# Altium project Motor_Board.PrjPcb
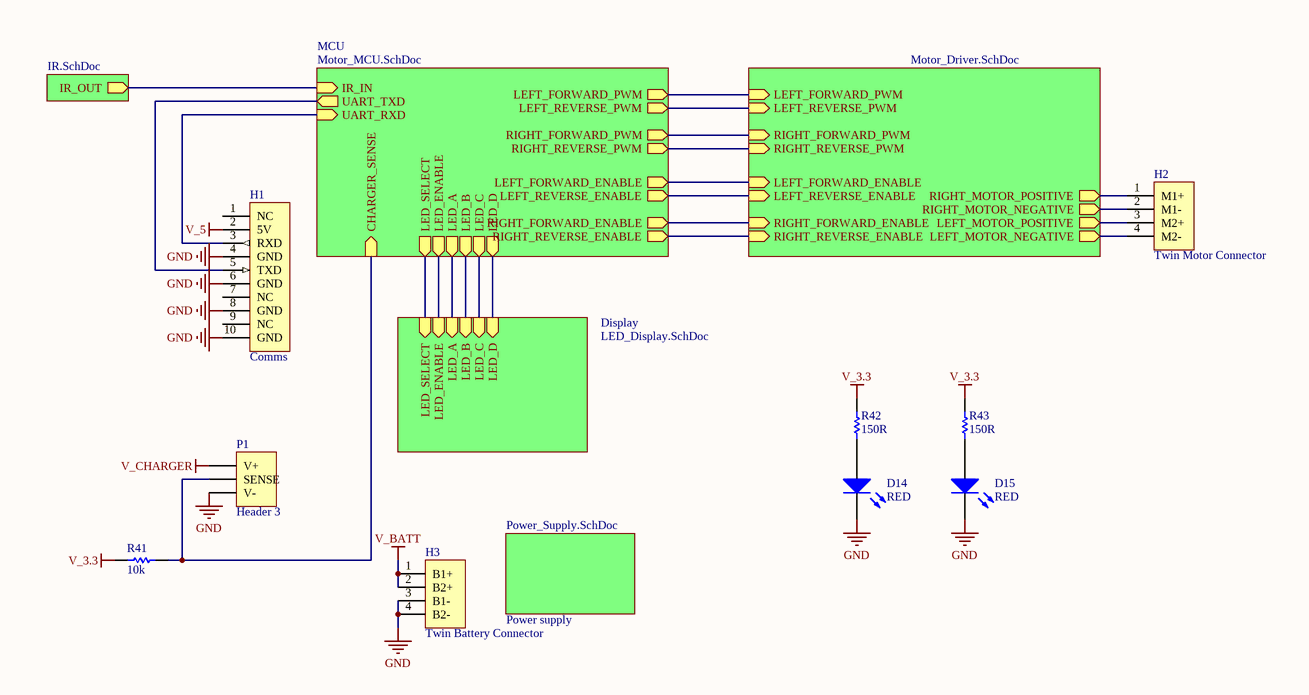
[diagram p0: Motor_Board.SchDoc]
6 sheets, 123 parts. Net scope: hierarchical (ports join the sheet entries above them; power ports are global).
Board file: Motor_Board.PcbDoc
Sheets:
  Motor_Board.SchDoc
    Power supply = Power_Supply.SchDoc
     = Motor_Driver.SchDoc
     = IR.SchDoc
    MCU = Motor_MCU.SchDoc
    Display = LED_Display.SchDoc

## Sheet Motor_Board.SchDoc: Top Level - Motor Board
size A4; DrawnBy: wgl18, hvj10; Organization: ENEL429 Group 9; Address1: ECE Department; Address2: University of Canterbury; Address3: Christchurch 8041; Address4: New Zealand; Revision: 1; SheetNumber: 1; SheetTotal: 5

### Parts
D14  value RED  [Diode_0805]  (hidden comment: LED Red)
D15  value RED  [Diode_0805]  (hidden comment: LED Red)
H1  Comms  [918510x323]
H2  Twin Motor Connector  [TMHDR4]
H3  Twin Battery Connector  [TMHDR4]
P1  Header 3  [DC power jack]
R41  10k  [0603]
R42  150R  [0603]
R43  150R  [0603]

### Sub-sheets
Display = LED_Display.SchDoc: LED_ENABLE (in), LED_A (in), LED_B (in), LED_C (in), LED_D (in), LED_SELECT (in)
MCU = Motor_MCU.SchDoc: LEFT_FORWARD_PWM (out), LEFT_REVERSE_PWM (out), RIGHT_REVERSE_PWM (out), RIGHT_FORWARD_PWM (out), UART_RXD (in), UART_TXD (out), IR_IN (in), LED_SELECT (out), LED_ENABLE (out), LED_A (out), LED_B (out), LED_C (out), LED_D (out), LEFT_FORWARD_ENABLE (out), LEFT_REVERSE_ENABLE (out), RIGHT_REVERSE_ENABLE (out), RIGHT_FORWARD_ENABLE (out), CHARGER_SENSE (in)
Power supply = Power_Supply.SchDoc: no entries
? = Motor_Driver.SchDoc: LEFT_FORWARD_PWM (in), RIGHT_REVERSE_PWM (in), LEFT_MOTOR_POSITIVE (out), RIGHT_MOTOR_POSITIVE (out), LEFT_REVERSE_PWM (in), RIGHT_FORWARD_PWM (in), RIGHT_MOTOR_NEGATIVE (out), LEFT_MOTOR_NEGATIVE (out), RIGHT_REVERSE_ENABLE (in), RIGHT_FORWARD_ENABLE (in), LEFT_FORWARD_ENABLE (in), LEFT_REVERSE_ENABLE (in)
? = IR.SchDoc: IR_OUT (out)

### Nets
GND: D14.2(K) D15.2(K) H1.4(GND) H1.6(GND) H1.8(GND) H1.10(GND) H3.3(B1-) H3.4(B2-) P1.3(V-)
V_3.3: R41.1 R42.2 R43.2
V_5: H1.2(5V)
V_BATT: H3.1(B1+) H3.2(B2+)
V_CHARGER: P1.1(V+)
PA0: sheet MCU/LED_A, sheet Display/LED_A
PA1: sheet MCU/LED_B, sheet Display/LED_B
PA2: sheet MCU/LED_C, sheet Display/LED_C
PA3: sheet MCU/LED_D, sheet Display/LED_D
PA6: sheet MCU/LED_ENABLE, sheet Display/LED_ENABLE
PA7: sheet MCU/LED_SELECT, sheet Display/LED_SELECT
PB2: P1.2(SENSE) R41.2 ; sheet MCU/CHARGER_SENSE
PD0: sheet /IR_OUT, sheet MCU/IR_IN
PD2: H1.3(RXD) ; sheet MCU/UART_RXD
PD3: H1.5(TXD) ; sheet MCU/UART_TXD
PD4: sheet /RIGHT_REVERSE_ENABLE, sheet MCU/RIGHT_REVERSE_ENABLE
PD5: sheet /RIGHT_FORWARD_ENABLE, sheet MCU/RIGHT_FORWARD_ENABLE
PD6: sheet /LEFT_FORWARD_ENABLE, sheet MCU/LEFT_FORWARD_ENABLE
PD7: sheet /LEFT_REVERSE_ENABLE, sheet MCU/LEFT_REVERSE_ENABLE
PE0: sheet /RIGHT_FORWARD_PWM, sheet MCU/RIGHT_FORWARD_PWM
PE1: sheet /RIGHT_REVERSE_PWM, sheet MCU/RIGHT_REVERSE_PWM
PE2: sheet /LEFT_REVERSE_PWM, sheet MCU/LEFT_REVERSE_PWM
PE3: sheet /LEFT_FORWARD_PWM, sheet MCU/LEFT_FORWARD_PWM
Net*1_6: H2.3(M2+) ; sheet /LEFT_MOTOR_POSITIVE
Net*2_6: H2.4(M2-) ; sheet /LEFT_MOTOR_NEGATIVE
Net*3_6: H2.1(M1+) ; sheet /RIGHT_MOTOR_POSITIVE
Net*4_6: H2.2(M1-) ; sheet /RIGHT_MOTOR_NEGATIVE
NetD14_1: D14.1(A) R42.1
NetD15_1: D15.1(A) R43.1

Not connected (* = marked no-connect by the designer): H1 1(NC) 7(NC) 9(NC)

### Notes on the sheet
- Title
- Drawn by:
- Date:
- Time:
- Revision:
- Sheet
- of
- File:

### Library data of the parts
D14 D15 = DL_LED Red 0805: Red LED 0805; Manufacturer PN: TLMS2100-GS08; Manufacturer: Vishay; Supplier 1: Digi-Key; Supplier Part Number 1: 350-2038-1-ND; Part Number: DL_LED Red 0805; Component Kind: Standard; Component Type: Standard; Designator: DL_LED Red 0805; Pin Count: 2; Simulation: LED0
H1 = Header 10: Header, IDC 10-Pin; LatestRevisionDate: 17-Jul-2002; LatestRevisionNote: Re-released for DXP Platform.; Publisher: Altium Limited
H2 H3 = AVR ISP Header 4: 5.08mm Pluggable Terminal Header; LatestRevisionDate: 17-Jul-2002; LatestRevisionNote: Re-released for DXP Platform.; Publisher: Altium Limited
P1 = Header 3: Header, 3-Pin; pin to pad: 1>3 3>1; LatestRevisionDate: 17-Jul-2002; LatestRevisionNote: Re-released for DXP Platform.; Publisher: Altium Limited
R41 = RS_10k 0603: RES 10.0K OHM 1/10W 1% 0603 SMD; Manufacturer: Yageo; Manufacturer PN: RC0603FR-0710KL; LatestRevisionDate: 29 May 08; Supplier 1: Digi-Key; Supplier Part Number 1: 311-10.0KHRTR-ND; Value: 10k; Part Number: RS_10k 0603; Component Kind: Standard; Component Type: Standard; Designator: RS_10k 0603; Pin Count: 2; Signal Integrity: Res; Simulation: RESISTOR
R42 R43 = RS_150R 0603: RES 150 OHM 1/10W 1% 0603 SMD; Manufacturer: ROHM; Manufacturer PN: MCR03EZPFX1500; LatestRevisionDate: 4th July 08; Supplier 1: Digi-Key; Supplier Part Number 1: RHM150HTR-ND; Value: 150R; Part Number: RS_150R 0603; Component Kind: Standard; Component Type: Standard; Designator: RS_150R 0603; Pin Count: 2; Signal Integrity: Res; Simulation: RESISTOR

## Sheet Power_Supply.SchDoc: Power Supply
size A4; DrawnBy: hvj10; Organization: ENEL429 Group 9; Address1: ECE Department; Address2: University of Canterbury; Address3: Christchurch 8041; Address4: New Zealand; Revision: 1; SheetNumber: 3; SheetTotal: 5
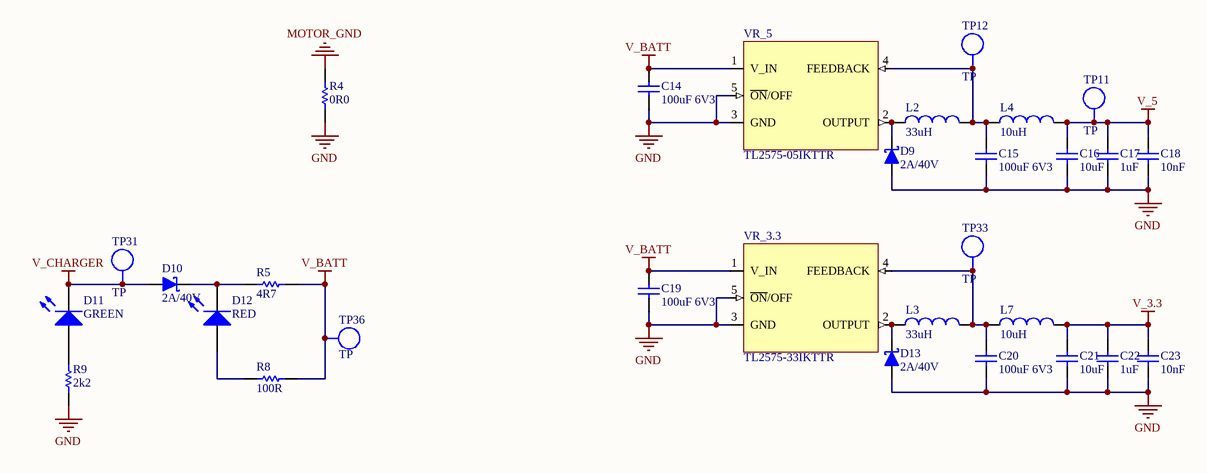
[diagram p1: Power_Supply.SchDoc]

### Parts
C14  100uF 6V3  [1206]
C15  100uF 6V3  [1206]
C16  10uF  [0805]
C17  1uF  [0603]
C18  10nF  [0603]
C19  100uF 6V3  [1206]
C20  100uF 6V3  [1206]
C21  10uF  [0805]
C22  1uF  [0603]
C23  10nF  [0603]
D9  2A/40V  [SMB_DIODE]
D10  2A/40V  [SMB_DIODE]
D11  value GREEN  [DIODE_0805]  (hidden comment: LED Green)
D12  value RED  [Diode_0805]  (hidden comment: LED Red)
D13  2A/40V  [SMB_DIODE]
L2  value 33uH  [DR124]  (hidden comment: Inductor)
L3  value 33uH  [DR124]  (hidden comment: Inductor)
L4  10uH  [WE-PD]
L7  10uH  [WE-PD]
R4  0R0  [0603]  (no BOM)
R5  4R7  [0603]
R8  100R  [0603]
R9  2k2  [0603]
TP11  TP  [TEST_POINT_4X2MM]  (no BOM)
TP12  TP  [TEST_POINT_4X2MM]  (no BOM)
TP31  TP  [TEST_POINT_4X2MM]  (no BOM)
TP33  TP  [TEST_POINT_4X2MM]  (no BOM)
TP36  TP  [TEST_POINT_4X2MM]  (no BOM)
VR_3.3  TL2575-33IKTTR  [TO170P1524X483-6N]
VR_5  TL2575-05IKTTR  [TO170P1524X483-6N]

### Nets
GND: C14.1 C15.1 C16.1 C17.1 C18.1 C19.1 C20.1 C21.1 C22.1 C23.1 D9.1(A) D13.1(A) R4.2 R9.1 VR_3.3.3(GND) VR_3.3.5(~{ON}/OFF) VR_3.3.6(GND) VR_5.3(GND) VR_5.5(~{ON}/OFF) VR_5.6(GND)
MOTOR_GND: R4.1
V_3.3: C21.2 C22.2 C23.2 L7.2
V_5: C16.2 C17.2 C18.2 L4.2 TP11.1
V_BATT: C14.2 C19.2 R5.2 R8.2 TP36.1 VR_3.3.1(V_IN) VR_5.1(V_IN)
V_CHARGER: D10.1(A) D11.2(K) TP31.1
NetC15_2: C15.2 L2.2 L4.1 TP12.1 VR_5.4(FEEDBACK)
NetC20_2: C20.2 L3.2 L7.1 TP33.1 VR_3.3.4(FEEDBACK)
NetD9_2: D9.2(K) L2.1 VR_5.2(OUTPUT)
NetD10_2: D10.2(K) D12.2(K) R5.1
NetD11_1: D11.1(A) R9.2
NetD12_1: D12.1(A) R8.1
NetD13_2: D13.2(K) L3.1 VR_3.3.2(OUTPUT)

### Notes on the sheet
- Title
- Drawn by:
- Date:
- Time:
- Revision:
- Sheet
- of
- File:

### Library data of the parts
C14 C15 C19 C20 = CP_CER 100uF_1206_6V3: 100uF 6.3V 1206 multi-layer ceramic capacitor; Manufacturer PN: C1206C107M9PACTU; Manufacturer: Kemet; Supplier Part Number 1: 399-5620-1-ND; price: 2.56; Supplier 1: Digi-Key; value: 100uF 6V3; Part Number: CP_CER 100uF_1206_6V3; Component Kind: Standard; Component Type: Standard; Designator: CP_CER 100uF_1206_6V3; Pin Count: 2
C16 C21 = CP_10uF 0805: CAP 10uF 10% 10V X5R 0805; Manufacturer: Murata; Manufacturer PN: GRM219R61A106KE44D; LatestRevisionDate: 29 May 08; Supplier 1: Digi-Key; Supplier Part Number 1: 490-4735-1-ND; Value: 10uF; Part Number: CP_10uF 0805; Component Kind: Standard; Component Type: Standard; Designator: CP_10uF 0805; Pin Count: 2
C17 C22 = CP_1uF_50V_0603: CAP CER 1.0UF 50V X7R 0603; Manufacturer: Taiyo Yuden; Manufacturer PN: UMK107C5105KA-T; Supplier Part Number 1: 445-5090-2-ND; Supplier 1: Digi-Key; Value: 1uF; Part Number: CP_1uF_50V_0603; Component Kind: Standard; Component Type: Standard; Designator: CP_1uF_50V_0603; Pin Count: 2; Signal Integrity: Cap; Simulation: CAP
C18 C23 = CP_10nF 0603: CAP CER 10000PF 100V X7R 0603; Manufacturer: Taiyo Yuden; Manufacturer PN: HMK107B7103KA-T; Supplier 1: Digi-Key; Supplier Part Number 1: 587-1446-2-ND; Value: 10nF; Part Number: CP_10nF 0603; Component Kind: Standard; Component Type: Standard; Designator: CP_10nF 0603; Pin Count: 2; Signal Integrity: Cap; Simulation: CAP
D9 D10 D13 = DS_SS230TP: Schottky Diode - 2A/30V; Manufacturer: Discrete Semiconductor Products; Manufacturer PN: SS23; Signal Integrity: D Schottky; LatestRevisionDate: 20 Feb 09; Supplier Part Number 1: SS23-TPMSCT-ND; Supplier 1: Digi-Key; Value: 2A/40V; Part Number: DS_SS230TP; Component Kind: Standard; Component Type: Standard; Designator: DS_SS230TP; Pin Count: 2; Simulation: SKYDIODE
D11 = DL_LED Green 0805: Green LED 0805; Manufacturer: Vishay; Verify: Not checked; Supplier 1: Digi-Key; Supplier Part Number 1: 160-1179-2-ND; Part Number: DL_LED Green 0805; Component Kind: Standard; Component Type: Standard; Designator: DL_LED Green 0805; Footprint: LED_RA_SMD; Pin Count: 2; Simulation: LED0
D12 = DL_LED Red 0805: as D14 on sheet Motor_Board; Supplier 1: Digi-Key; Supplier Part Number 1: 350-2038-1-ND; Part Number: DL_LED Red 0805; Component Kind: Standard; Component Type: Standard; Designator: DL_LED Red 0805; Pin Count: 2; Simulation: LED0
L2 L3 = IN_33u 2A SMT: INDUCTOR POWER SHIELD 33UH 2.6A SMD; Manufacturer: Coiltronics; Manufacturer PN: DR124-330-R; Verify: Not Checked; LatestRevisionDate: 20 Feb 09; Supplier 1: Digi-Key; Supplier Part Number 1: 513-1435-1-ND; Part Number: IN_33u 2A SMT; Component Kind: Standard; Component Type: Standard; Designator: IN_33u 2A SMT; Pin Count: 2; Signal Integrity: Inductor; Simulation: INDUCTOR
L4 L7 = IN_10uH 2A SMT: INDUCTOR POWER 10UH 2.0A SMD; Manufacturer: Wurth Electronics Inc; Manufacturer PN: 744777910; LatestRevisionDate: 29 May 08; Supplier 1: Digi-Key; Supplier Part Number 1: 732-1191-1-ND; Value: 10uH; Part Number: IN_10uH 2A SMT; Component Kind: Standard; Component Type: Standard; Designator: IN_10uH 2A SMT; Pin Count: 2; Signal Integrity: Inductor; Simulation: INDUCTOR
R4 = RS_0R0 0603: RES 0.0 OHM 1/10W 5% 0603 SMD; Manufacturer: Rohm; Manufacturer PN: MCR03EZPJ000; LatestRevisionDate: 3 Jun 08; Supplier 1: Digi-Key; Supplier Part Number 1: RHM0.0GTR-ND; Value: 0R0; Part Number: RS_0R0 0603; Component Type: Standard (No BOM); Designator: RS_0R0 0603; Pin Count: 2; Signal Integrity: Res; Simulation: RESISTOR
R5 = RS_4R7_0603: RES 4.7R 1/10W 5% 0603 SMD; Manufacturer: Yageo; Manufacturer PN: RC0603JR-074R7L; Verify: Not Checked; LatestRevisionDate: 20 Feb 09; Supplier 1: Digi-Key; Supplier Part Number 1: 311-4.7GRTR-ND; Value: 4R7; Part Number: RS_4R7_0603; Component Kind: Standard; Component Type: Standard; Designator: RS_4R7_0603; Pin Count: 2; Signal Integrity: Res; Simulation: RESISTOR
R8 = RS_100R 0603: RES 100 OHM 1/10W 1% 0603 SMD; Manufacturer: ROHM; Manufacturer PN: MCR03EZPFX1000; LatestRevisionDate: n/a; Supplier 1: Digi-Key; Supplier Part Number 1: RHM100HTR-ND; Value: 100R; Part Number: RS_100R 0603; Component Kind: Standard; Component Type: Standard; Designator: RS_100R 0603; Pin Count: 2; Signal Integrity: Res; Simulation: RESISTOR
R9 = RS_2k2 0603: RES 2.2K OHM 1/10W 5% 0603 SMD; Manufacturer: Yageo; Manufacturer PN: RC0603JR-072K2L; LatestRevisionDate: 1 Jun 08; Supplier 1: Digi-Key; Supplier Part Number 1: 311-2.2KGRTR-ND; Value: 2k2; Part Number: RS_2k2 0603; Component Kind: Standard; Component Type: Standard; Designator: RS_2k2 0603; Pin Count: 2; Signal Integrity: Res; Simulation: RESISTOR
TP11 TP12 TP31 TP33 TP36 = TP_TESTPOINT: Test-Point; Value: TP; Part Number: TP_TESTPOINT; Component Type: Standard (No BOM); Designator: TP_TESTPOINT; Pin Count: 1; LatestRevisionDate: 29 May 08; Manufacturer PN: *; Manufacturer: *; Supplier 1: Digi-Key; Supplier Part Number 1: 5016KTR-ND
VR_3.3 = TL2575-33IKTTR: Manufacturer: TEXAS INSTRUMENTS; Manufacturer PN: TL2575-33IKTTR; Supplier 1: TI Samples; Supplier Part Number 1: TL2575-33IKTTR; Supplier 2: Digikey; Supplier Part Number 2: 296-21828-1-ND
VR_5 = TL2575-05IKTTR: Manufacturer: TEXAS INSTRUMENTS; Manufacturer PN: TL2575-05IKTTR; Supplier 1: TI Samples; Supplier Part Number 1: TL2575-05IKTTR

## Sheet Motor_Driver.SchDoc: Motor Driver
size A4; DrawnBy: wgl18; Organization: ENEL429 Group 9; Address1: ECE Department; Address2: University of Canterbury; Address3: Christchurch 8041; Address4: New Zealand; Revision: 1; SheetNumber: 4; SheetTotal: 5
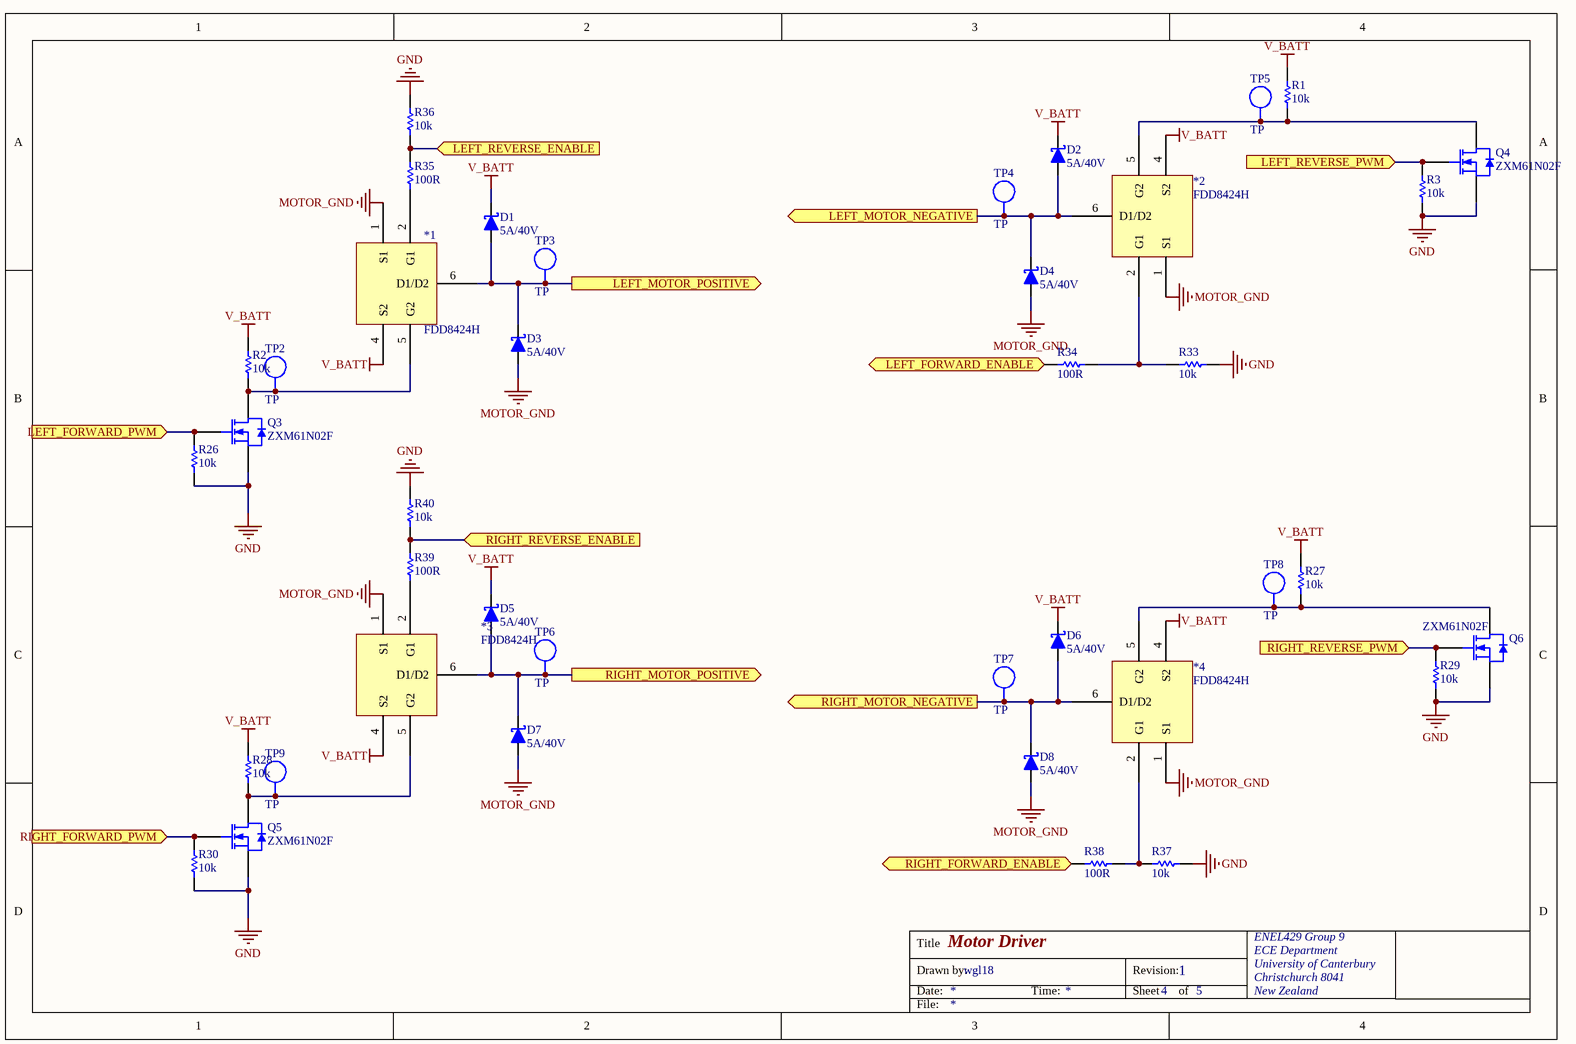
[diagram p2: Motor_Driver.SchDoc]

### Parts
*1  FDD8424H  [TO114P990X239-5N]
*2  FDD8424H  [TO114P990X239-5N]
*3  FDD8424H  [TO114P990X239-5N]
*4  FDD8424H  [TO114P990X239-5N]
D1  5A/40V  [DIODE_SMC]
D2  5A/40V  [DIODE_SMC]
D3  5A/40V  [DIODE_SMC]
D4  5A/40V  [DIODE_SMC]
D5  5A/40V  [DIODE_SMC]
D6  5A/40V  [DIODE_SMC]
D7  5A/40V  [DIODE_SMC]
D8  5A/40V  [DIODE_SMC]
Q3  ZXM61N02F  [SOT-23]
Q4  ZXM61N02F  [SOT-23]
Q5  ZXM61N02F  [SOT-23]
Q6  ZXM61N02F  [SOT-23]
R1  10k  [0603]
R2  10k  [0603]
R3  10k  [0603]
R26  10k  [0603]
R27  10k  [0603]
R28  10k  [0603]
R29  10k  [0603]
R30  10k  [0603]
R33  10k  [0603]
R34  100R  [0603]
R35  100R  [0603]
R36  10k  [0603]
R37  10k  [0603]
R38  100R  [0603]
R39  100R  [0603]
R40  10k  [0603]
TP2  TP  [TEST_POINT_4X2MM]  (no BOM)
TP3  TP  [TEST_POINT_4X2MM]  (no BOM)
TP4  TP  [TEST_POINT_4X2MM]  (no BOM)
TP5  TP  [TEST_POINT_4X2MM]  (no BOM)
TP6  TP  [TEST_POINT_4X2MM]  (no BOM)
TP7  TP  [TEST_POINT_4X2MM]  (no BOM)
TP8  TP  [TEST_POINT_4X2MM]  (no BOM)
TP9  TP  [TEST_POINT_4X2MM]  (no BOM)

### Ports
LEFT_FORWARD_ENABLE (in), LEFT_FORWARD_PWM (in), LEFT_MOTOR_NEGATIVE (out), LEFT_MOTOR_POSITIVE (out), LEFT_REVERSE_ENABLE (in), LEFT_REVERSE_PWM (in), RIGHT_FORWARD_ENABLE (in), RIGHT_FORWARD_PWM (in), RIGHT_MOTOR_NEGATIVE (out), RIGHT_MOTOR_POSITIVE (out), RIGHT_REVERSE_ENABLE (in), RIGHT_REVERSE_PWM (in)

### Nets
GND: Q3.2(S) Q4.2(S) Q5.2(S) Q6.2(S) R3.1 R26.2 R29.1 R30.2 R33.2 R36.1 R37.2 R40.1
MOTOR_GND: *1.1(S1) *2.1(S1) *3.1(S1) *4.1(S1) D3.1(A) D4.1(A) D7.1(A) D8.1(A)
V_BATT: *1.4(S2) *2.4(S2) *3.4(S2) *4.4(S2) D1.2(K) D2.2(K) D5.2(K) D6.2(K) R1.2 R2.1 R27.2 R28.1
PD4: R39.2 R40.2 ; port RIGHT_REVERSE_ENABLE
PD5: R38.1 ; port RIGHT_FORWARD_ENABLE
PD6: R34.1 ; port LEFT_FORWARD_ENABLE
PD7: R35.2 R36.2 ; port LEFT_REVERSE_ENABLE
PE0: Q5.1(G) R30.1 ; port RIGHT_FORWARD_PWM
PE1: Q6.1(G) R29.2 ; port RIGHT_REVERSE_PWM
PE2: Q4.1(G) R3.2 ; port LEFT_REVERSE_PWM
PE3: Q3.1(G) R26.1 ; port LEFT_FORWARD_PWM
Net*1_2: *1.2(G1) R35.1
Net*1_5: *1.5(G2) Q3.3(D) R2.2 TP2.1
Net*1_6: *1.6(D1/D2) D1.1(A) D3.2(K) TP3.1 ; port LEFT_MOTOR_POSITIVE
Net*2_2: *2.2(G1) R33.1 R34.2
Net*2_5: *2.5(G2) Q4.3(D) R1.1 TP5.1
Net*2_6: *2.6(D1/D2) D2.1(A) D4.2(K) TP4.1 ; port LEFT_MOTOR_NEGATIVE
Net*3_2: *3.2(G1) R39.1
Net*3_5: *3.5(G2) Q5.3(D) R28.2 TP9.1
Net*3_6: *3.6(D1/D2) D5.1(A) D7.2(K) TP6.1 ; port RIGHT_MOTOR_POSITIVE
Net*4_2: *4.2(G1) R37.1 R38.2
Net*4_5: *4.5(G2) Q6.3(D) R27.1 TP8.1
Net*4_6: *4.6(D1/D2) D6.1(A) D8.2(K) TP7.1 ; port RIGHT_MOTOR_NEGATIVE

Not connected (* = marked no-connect by the designer): *1 3(DNC); *2 3(DNC); *3 3(DNC); *4 3(DNC)

### Notes on the sheet
- Title
- Drawn by:
- Date:
- Time:
- Revision:
- Sheet
- of
- File:

### Library data of the parts
*1-*4 = FDD8424H: Manufacturer: Fairchild Semiconductor; Supplier 1: Digikey; Manufacturer PN: FDD8424H; Supplier Part Number 1: FDD8424HCT-ND
D1-D8 = DS_SSC54-E3/57T: DIODE SCHOTTKY 5A 40V SMC; Manufacturer: Vishay; Verify: Not Checked; Value: 5A/40V; Part Number: DS_SSC54-E3/57T; Component Kind: Standard; Component Type: Standard; Designator: DS_SSC54-E3/57T; Pin Count: 2; LatestRevisionDate: 2 Mar 09; Manufacturer PN: SSC54-E3/57T; Supplier 1: Digi-Key; Supplier Part Number 1: SSC54-E3/57TGICT-ND
Q3-Q6 = TF_ZXM61N02F: 20V N-channel enhancement mode MOSFET; Manufacturer: Zetex; Supplier 1: Element 14; Supplier Part Number 1: 9525270; price: 1.28; Supplier 2: Digi-Key; Supplier Part Number 2: ZXM61N02FCT-ND; value: ZXM61N02F; Part Number: TF_ZXM61N02F; Component Kind: Standard; Component Type: Standard; Designator: TF_ZXM61N02F; Pin Count: 3; PCB3D: sot23
R1-R3 R26-R30 R33 R36 R37 R40 = RS_10k 0603: as R41 on sheet Motor_Board; LatestRevisionDate: 29 May 08; Supplier 1: Digi-Key; Supplier Part Number 1: 311-10.0KHRTR-ND; Value: 10k; Part Number: RS_10k 0603; Component Kind: Standard; Component Type: Standard; Designator: RS_10k 0603; Pin Count: 2; Signal Integrity: Res; Simulation: RESISTOR
R34 R35 R38 R39 = RS_100R 0603: as R8 on sheet Power_Supply; LatestRevisionDate: n/a; Supplier 1: Digi-Key; Supplier Part Number 1: RHM100HTR-ND; Value: 100R; Part Number: RS_100R 0603; Component Kind: Standard; Component Type: Standard; Designator: RS_100R 0603; Pin Count: 2; Signal Integrity: Res; Simulation: RESISTOR
TP2-TP9 = TP_TESTPOINT: Test-Point; Value: TP; Part Number: TP_TESTPOINT; LatestRevisionDate: 29 May 08; Manufacturer PN: *; Manufacturer: *; Supplier 1: Digi-Key; Supplier Part Number 1: 5016KTR-ND; Component Type: Standard (No BOM); Designator: TP_TESTPOINT; Pin Count: 1

## Sheet IR.SchDoc: IR Module
size A4; DrawnBy: djb216; Organization: ENEL429 Group 9; Address1: ECE Department; Address2: University of Canterbury; Address3: Christchurch 8041; Address4: New Zealand; Revision: 2; SheetNumber: 5; SheetTotal: 5
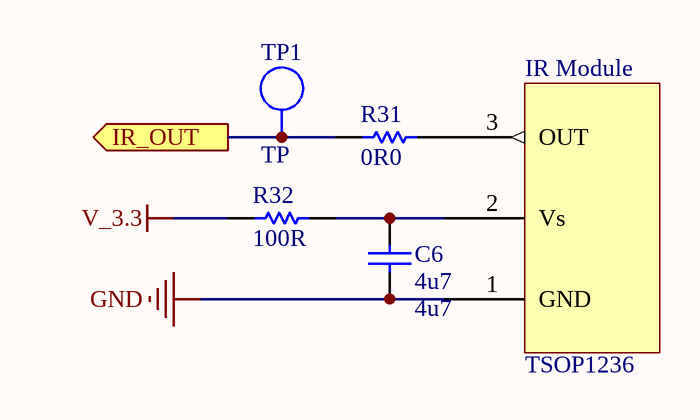
[diagram p3: IR.SchDoc]

### Parts
C6  4u7  [0603]
IR_Module  TSOP1236  [TSOP1236 IR Receiver]
R31  0R0  [0603]  (no BOM)
R32  100R  [0603]
TP1  TP  [TEST_POINT_4X2MM]  (no BOM)

### Ports
IR_OUT (out)

### Nets
GND: C6.2 IR_Module.1(GND)
V_3.3: R32.1
PD0: R31.1 TP1.1 ; port IR_OUT
NetC6_1: C6.1 IR_Module.2(Vs) R32.2
NetIR_Module_3: IR_Module.3(OUT) R31.2

### Notes on the sheet
- Title
- Drawn by:
- Date:
- Time:
- Revision:
- Sheet
- of
- File:

### Library data of the parts
C6 = CP_4u7 0603: CAP CER 4.7UF 10V X5R 0603; Manufacturer: Taiyo Yuden LMK107BJ475KA-T; Value: 4u7; Part Number: CP_4u7 0603; Component Kind: Standard; Component Type: Standard; Designator: CP_4u7 0603; Pin Count: 2; LatestRevisionDate: 29 May 08; Supplier 1: Digi-Key; Supplier Part Number 1: 587-1441-1-ND; Simulation: CAP
IR_Module = TSOP1236: Manufacturer: VISHAY; Manufacturer PN: TSOP1236; Supplier Part Number 1: 4913048; Supplier 1: Element14
R31 = RS_0R0 0603: as R4 on sheet Power_Supply; LatestRevisionDate: 3 Jun 08; Supplier 1: Digi-Key; Supplier Part Number 1: RHM0.0GTR-ND; Value: 0R0; Part Number: RS_0R0 0603; Component Type: Standard (No BOM); Designator: RS_0R0 0603; Pin Count: 2; Signal Integrity: Res; Simulation: RESISTOR
R32 = RS_100R 0603: as R8 on sheet Power_Supply; Value: 100R; Part Number: RS_100R 0603; Component Kind: Standard; Component Type: Standard; Designator: RS_100R 0603; Pin Count: 2; LatestRevisionDate: n/a; Supplier 1: Digi-Key; Supplier Part Number 1: RHM100HTR-ND; Signal Integrity: Res; Simulation: RESISTOR
TP1 = TP_TESTPOINT: Test-Point; Value: TP; Part Number: TP_TESTPOINT; Component Type: Standard (No BOM); Designator: TP_TESTPOINT; Pin Count: 1; LatestRevisionDate: 29 May 08; Manufacturer PN: *; Manufacturer: *; Supplier 1: Digi-Key; Supplier Part Number 1: 5016KTR-ND

## Sheet Motor_MCU.SchDoc: Motor MCU
size A4; Author: wgl18; DrawnBy: wgl18; Organization: ENEL429 Group 9; Address1: ECE Department; Address2: University of Canterbury; Address3: Christchurch 8041; Address4: New Zealand; DocumentNumber: 1; Revision: 1; SheetNumber: 2; SheetTotal: 5; ProjectName: Wacky Racers
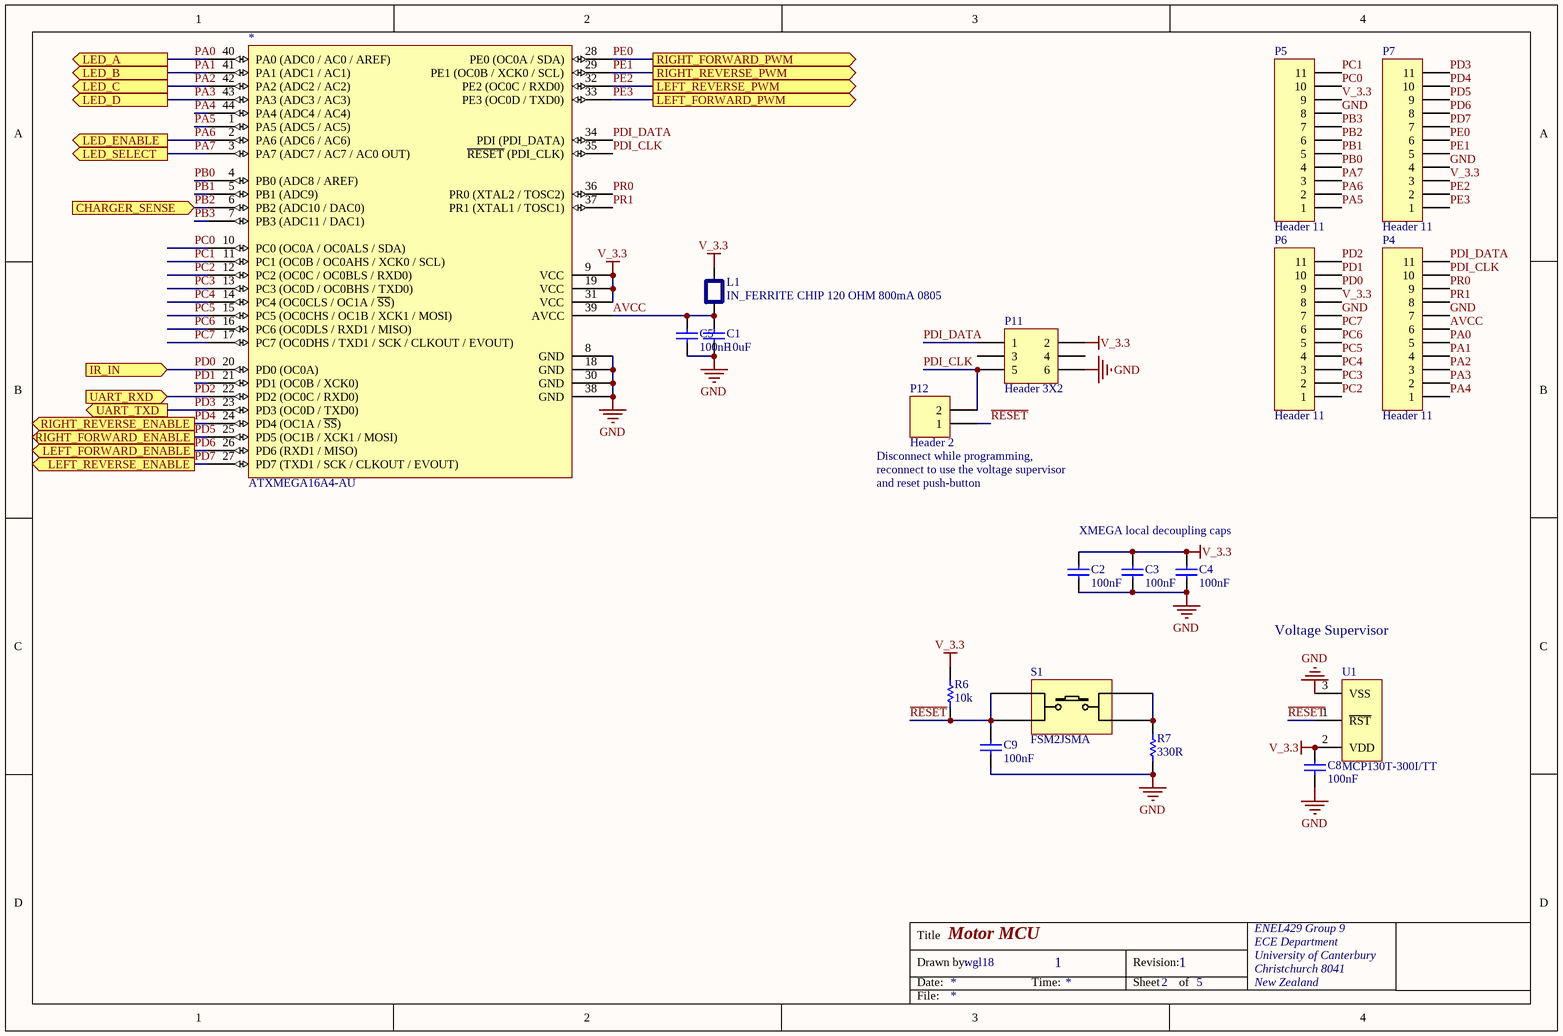
[diagram p4: Motor_MCU.SchDoc]

### Parts
*  ATXMEGA16A4-AU  [TQFP80P1200X1200X120-44N]
C1  10uF  [0805]
C2  100nF  [0603]
C3  100nF  [0603]
C4  100nF  [0603]
C5  100nF  [0603]
C8  100nF  [0603]
C9  100nF  [0603]
L1  IN_FERRITE CHIP 120 OHM 800mA 0805  [0805]
P4  Header 11  [HDR1X11]
P5  Header 11  [HDR1X11]
P6  Header 11  [HDR1X11]
P7  Header 11  [HDR1X11]
P11  Header 3X2  [HDR2X3]
P12  Header 2  [HDR1X2]
R6  10k  [0603]
R7  330R  [0603]
S1  FSM2JSMA  [FSM2JSMA]
U1  MCP130T-300I/TT  [SOT-23-TT3_N]

### Ports
CHARGER_SENSE (in), IR_IN (in), LED_A (out), LED_B (out), LED_C (out), LED_D (out), LED_ENABLE (out), LED_SELECT (out), LEFT_FORWARD_ENABLE (out), LEFT_FORWARD_PWM (out), LEFT_REVERSE_ENABLE (out), LEFT_REVERSE_PWM (out), RIGHT_FORWARD_ENABLE (out), RIGHT_FORWARD_PWM (out), RIGHT_REVERSE_ENABLE (out), RIGHT_REVERSE_PWM (out), UART_RXD (in), UART_TXD (out)

### Nets
GND: *.8(GND) *.18(GND) *.30(GND) *.38(GND) C1.2 C2.1 C3.1 C4.1 C5.1 C8.2 C9.2 P4.7 P5.8 P6.7 P7.4 P11.6 R7.1 U1.3(VSS)
V_3.3: *.9(VCC) *.19(VCC) *.31(VCC) C2.2 C3.2 C4.2 C8.1 L1.1 P5.9 P6.8 P7.3 P11.2 R6.2 U1.2(VDD)
AVCC: *.39(AVCC) C1.1 C5.2 L1.2 P4.6
PA0: *.40(PA0_(ADC0_/_AC0_/_AREF)) P4.5 ; port LED_A
PA1: *.41(PA1_(ADC1_/_AC1)) P4.4 ; port LED_B
PA2: *.42(PA2_(ADC2_/_AC2)) P4.3 ; port LED_C
PA3: *.43(PA3_(ADC3_/_AC3)) P4.2 ; port LED_D
PA4: *.44(PA4_(ADC4_/_AC4)) P4.1
PA5: *.1(PA5_(ADC5_/_AC5)) P5.1
PA6: *.2(PA6_(ADC6_/_AC6)) P5.2 ; port LED_ENABLE
PA7: *.3(PA7_(ADC7_/_AC7_/_AC0_OUT)) P5.3 ; port LED_SELECT
PB0: *.4(PB0_(ADC8_/_AREF)) P5.4
PB1: *.5(PB1_(ADC9)) P5.5
PB2: *.6(PB2_(ADC10_/_DAC0)) P5.6 ; port CHARGER_SENSE
PB3: *.7(PB3_(ADC11_/_DAC1)) P5.7
PC0: *.10(PC0_(OC0A_/_OC0ALS_/_SDA)) P5.10
PC1: *.11(PC1_(OC0B_/_OC0AHS_/_XCK0_/_SCL)) P5.11
PC2: *.12(PC2_(OC0C_/_OC0BLS_/_RXD0)) P6.1
PC3: *.13(PC3_(OC0D_/_OC0BHS_/_TXD0)) P6.2
PC4: *.14(PC4_(OC0CLS_/_OC1A_/_~{SS})) P6.3
PC5: *.15(PC5_(OC0CHS_/_OC1B_/_XCK1_/_MOSI)) P6.4
PC6: *.16(PC6_(OC0DLS_/_RXD1_/_MISO)) P6.5
PC7: *.17(PC7_(OC0DHS_/_TXD1_/_SCK_/_CLKOUT_/_EVOUT)) P6.6
PD0: *.20(PD0_(OC0A)) P6.9 ; port IR_IN
PD1: *.21(PD1_(OC0B_/_XCK0)) P6.10
PD2: *.22(PD2_(OC0C_/_RXD0)) P6.11 ; port UART_RXD
PD3: *.23(PD3_(OC0D_/_TXD0)) P7.11 ; port UART_TXD
PD4: *.24(PD4_(OC1A_/_~{SS})) P7.10 ; port RIGHT_REVERSE_ENABLE
PD5: *.25(PD5_(OC1B_/_XCK1_/_MOSI)) P7.9 ; port RIGHT_FORWARD_ENABLE
PD6: *.26(PD6_(RXD1_/_MISO)) P7.8 ; port LEFT_FORWARD_ENABLE
PD7: *.27(PD7_(TXD1_/_SCK_/_CLKOUT_/_EVOUT)) P7.7 ; port LEFT_REVERSE_ENABLE
PDI_CLK: *.35(~{RESET}_(PDI_CLK)) P4.10 P11.5 P12.2
PDI_DATA: *.34(PDI_(PDI_DATA)) P4.11 P11.1
PE0: *.28(PE0_(OC0A_/_SDA)) P7.6 ; port RIGHT_FORWARD_PWM
PE1: *.29(PE1_(OC0B_/_XCK0_/_SCL)) P7.5 ; port RIGHT_REVERSE_PWM
PE2: *.32(PE2_(OC0C_/_RXD0)) P7.2 ; port LEFT_REVERSE_PWM
PE3: *.33(PE3_(OC0D_/_TXD0)) P7.1 ; port LEFT_FORWARD_PWM
PR0: *.36(PR0_(XTAL2_/_TOSC2)) P4.9
PR1: *.37(PR1_(XTAL1_/_TOSC1)) P4.8
~{RESET}: C9.1 P12.1 R6.1 S1.1 S1.2 U1.1(~{RST})
NetR7_2: R7.2 S1.3 S1.4

Not connected (* = marked no-connect by the designer): P11 3 4

### Notes on the sheet
- (near P12) Disconnect while programming,
- (near P12) reconnect to use the voltage supervisor
- and reset push-button
- XMEGA local decoupling caps
- Voltage Supervisor
- Title
- Drawn by:
- Date:
- Time:
- Revision:
- Sheet
- of
- File:

### Library data of the parts
* = ATXMEGA16A4-AU: Manufacturer: ATMEL; Manufacturer PN: ATXMEGA16A4-AU; Supplier 1: Element 14; Supplier Part Number 1: 1748552
C1 = CP_10uF 0805: as C16 on sheet Power_Supply; Value: 10uF; Part Number: CP_10uF 0805; Component Kind: Standard; Component Type: Standard; Designator: CP_10uF 0805; Pin Count: 2; LatestRevisionDate: 29 May 08; Supplier 1: Digi-Key; Supplier Part Number 1: 490-4735-1-ND
C2-C5 C8 C9 = CP_100nF 0603: CAP CER .10UF 50V X5R 0603; Manufacturer: Taiyo Yuden; Manufacturer PN: UMK107B7104KA-T; Value: 100nF; Part Number: CP_100nF 0603; Component Kind: Standard; Component Type: Standard; Designator: CP_100nF 0603; Pin Count: 2; LatestRevisionDate: 29 May 08; Supplier 1: Digi-Key; Supplier Part Number 1: 478-6206-1-ND; Signal Integrity: Cap; Simulation: CAP
L1 = IN_FERRITE CHIP 120 OHM 800mA 0805: FERRITE CHIP 120 OHM 800mA 0805; Manufacturer: TDK; Manufacturer PN: MMZ2012Y121B; Part Number: IN_FERRITE CHIP 120 OHM 800mA 0805; Component Kind: Standard; Component Type: Standard; Designator: IN_FERRITE CHIP 120 OHM 800mA 0805; Pin Count: 2; Supplier 1: Digi-Key; Supplier Part Number 1: 445-2196-2-ND
P4-P7 = Header 11: Header, 11-Pin; LatestRevisionDate: 17-Jul-2002; LatestRevisionNote: Re-released for DXP Platform.; Publisher: Altium Limited
P11 = Header 3X2: Header, 3-Pin, Dual row; LatestRevisionDate: 17-Jul-2002; LatestRevisionNote: Re-released for DXP Platform.; Publisher: Altium Limited
P12 = Header 2: Header, 2-Pin; LatestRevisionDate: 17-Jul-2002; LatestRevisionNote: Re-released for DXP Platform.; Publisher: Altium Limited
R6 = RS_10k 0603: as R41 on sheet Motor_Board; Value: 10k; Part Number: RS_10k 0603; Component Kind: Standard; Component Type: Standard; Designator: RS_10k 0603; Pin Count: 2; LatestRevisionDate: 29 May 08; Supplier 1: Digi-Key; Supplier Part Number 1: 311-10.0KHRTR-ND; Signal Integrity: Res; Simulation: RESISTOR
R7 = RS_330R 0603: RES 330 OHM 1/10W 1% 0603 SMD; Manufacturer: Yageo; Manufacturer PN: RC0603FR-07330RL; Value: 330R; Part Number: RS_330R 0603; Component Kind: Standard; Component Type: Standard; Designator: RS_330R 0603; Pin Count: 2; LatestRevisionDate: 25 June 2009; Supplier 1: Digi-Key; Supplier Part Number 1: 311-330HRTR-ND; Signal Integrity: Res; Simulation: RESISTOR
S1 = SW_FSM2JSMA: DPST SMD Switch; Manufacturer: Tyco Electronics; Supplier 1: Element 14; Supplier Part Number 1: 3801287; price: 0.516; Supplier 2: Digi-Key; Supplier Part Number 2: 450-1130-ND; value: FSM2JSMA; Part Number: SW_FSM2JSMA; Component Kind: Standard; Component Type: Standard; Designator: SW_FSM2JSMA; Pin Count: 4
U1 = MCP130T-300I/TT: Microcontroller Supervisory Circuit with Open Drain Output, 3-Pin SOT-23, Industrial Temperature, Tape and Reel; FirstPublished: 29-Jan-2009; DatasheetVersion: revD, 2001; PackageVersion: revBB, Aug-2009; PackageReference: SOT-23-TT3; Publisher: Altium Limited; PackageDescription: 3-Lead Plastic Small Outline Transistor (TT) [SOT-23]; Supplier 1: Digi-Key; Supplier Part Number 1: MCP130T-300I/TTTR-ND; Supplier 2: Digi-Key; Supplier Part Number 2: MCP130T-300I/TTCT-ND; Supplier 3: Digi-Key; Supplier Part Number 3: MCP130T-300I/TTDKR-ND; Supplier 4: Farnell; Supplier Part Number 4: 1332070; Supplier 5: Newark; Supplier Part Number 5: 19C7176; Code_IPC: SOT23-3; ComponentLink1Description: Datasheet; ComponentLink1URL: http://ww1.microchip.com/downloads/en/DeviceDoc/11184d.pdf; ComponentLink2Description: Packaging Specification; ComponentLink2URL: http://www.microchip.com/stellent/groups/techpub_sg/documents/packagingspec/en012702.pdf; ComponentLink3Description: Microchip.com Home; ComponentLink3URL: http://www.microchip.com/

## Sheet LED_Display.SchDoc
size A4; Organization: ENEL429 Group N; Address1: ECE Department; Address2: University of Canterbury; Address3: Christchurch 8041; Address4: New Zealand; Revision: 1
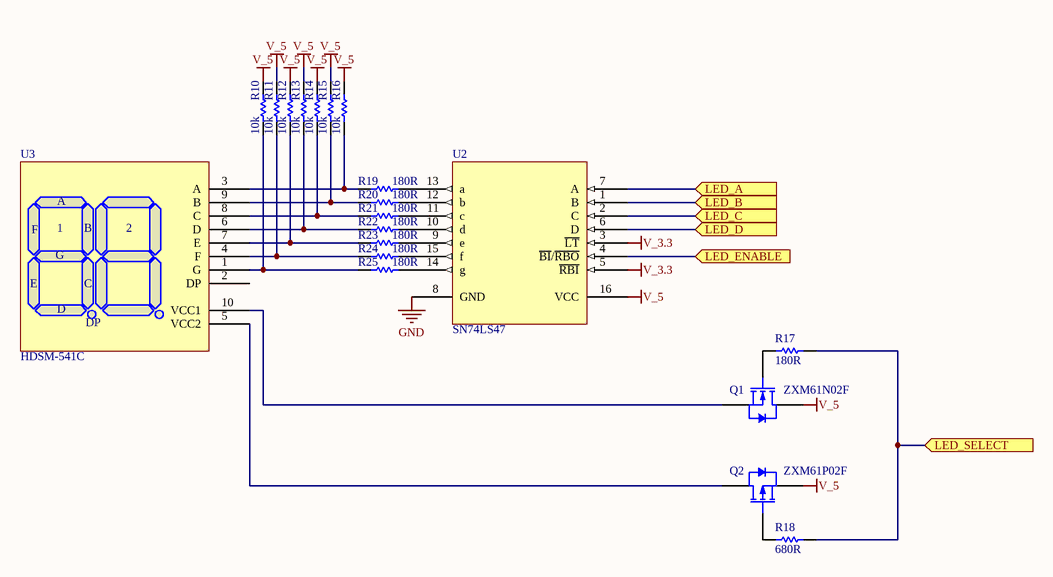
[diagram p5: LED_Display.SchDoc]

### Parts
Q1  ZXM61N02F  [SOT-23]
Q2  ZXM61P02F  [SOT23]
R10  10k  [0603]
R11  10k  [0603]
R12  10k  [0603]
R13  10k  [0603]
R14  10k  [0603]
R15  10k  [0603]
R16  10k  [0603]
R17  180R  [0603]
R18  680R  [0603]
R19  180R  [0603]
R20  180R  [0603]
R21  180R  [0603]
R22  180R  [0603]
R23  180R  [0603]
R24  180R  [0603]
R25  180R  [0603]
U2  SN74LS47  [SOP127P780X200-16N]
U3  HDSM-541C  [HDSM-541C]

### Ports
LED_A (in), LED_B (in), LED_C (in), LED_D (in), LED_ENABLE (in), LED_SELECT (in)

### Nets
GND: U2.8(GND)
V_3.3: U2.3(~{LT}) U2.5(~{RBI})
V_5: Q1.3(D) Q2.2(S) R10.2 R11.2 R12.2 R13.2 R14.2 R15.2 R16.2 U2.16(VCC)
PA0: U2.7(A) ; port LED_A
PA1: U2.1(B) ; port LED_B
PA2: U2.2(C) ; port LED_C
PA3: U2.6(D) ; port LED_D
PA6: U2.4(~{BI}/~{RBO}) ; port LED_ENABLE
PA7: R17.2 R18.2 ; port LED_SELECT
NetQ1_1: Q1.1(G) R17.1
NetQ1_2: Q1.2(S) U3.10(VCC1)
NetQ2_1: Q2.1(G) R18.1
NetQ2_3: Q2.3(D) U3.5(VCC2)
NetR10_1: R10.1 R25.1 U3.1(G)
NetR11_1: R11.1 R24.1 U3.4(F)
NetR12_1: R12.1 R23.1 U3.7(E)
NetR13_1: R13.1 R22.1 U3.6(D)
NetR14_1: R14.1 R21.1 U3.8(C)
NetR15_1: R15.1 R20.1 U3.9(B)
NetR16_1: R16.1 R19.1 U3.3(A)
NetR19_2: R19.2 U2.13(a)
NetR20_2: R20.2 U2.12(b)
NetR21_2: R21.2 U2.11(c)
NetR22_2: R22.2 U2.10(d)
NetR23_2: R23.2 U2.9(e)
NetR24_2: R24.2 U2.15(f)
NetR25_2: R25.2 U2.14(g)

Not connected (* = marked no-connect by the designer): U3 2(DP)

### Notes on the sheet
- Title
- Drawn by:
- Date:
- Time:
- Revision:
- Sheet
- of
- File:

### Library data of the parts
Q1 = TF_ZXM61N02F: as Q3 on sheet Motor_Driver; Supplier 1: Element 14; Supplier Part Number 1: 9525270; price: 1.28; Supplier 2: Digi-Key; Supplier Part Number 2: ZXM61N02FCT-ND; value: ZXM61N02F; Part Number: TF_ZXM61N02F; Component Kind: Standard; Component Type: Standard; Designator: TF_ZXM61N02F; Pin Count: 3; PCB3D: sot23
Q2 = TF_ZXM61P02F: 20V P-channel enhancement mode MOSFET; Manufacturer: Zetex; Supplier 1: Element 14; Supplier Part Number 1: 9525297; price: 1.31; Supplier 2: Digi-Key; Supplier Part Number 2: ZXM61P02FCT-ND; value: ZXM61P02F; Part Number: TF_ZXM61P02F; Component Kind: Standard; Component Type: Standard; Designator: TF_ZXM61P02F; Pin Count: 3; PCB3D: sot23
R10-R16 = RS_10k 0603: as R41 on sheet Motor_Board; LatestRevisionDate: 29 May 08; Supplier 1: Digi-Key; Supplier Part Number 1: 311-10.0KHRTR-ND; Value: 10k; Part Number: RS_10k 0603; Component Kind: Standard; Component Type: Standard; Designator: RS_10k 0603; Pin Count: 2; Signal Integrity: Res; Simulation: RESISTOR
R17 R19-R25 = RS_180R 0603: RES 180OHM 1/10W 1% 0603 SMD; Manufacturer: Panasonic - ECG; Manufacturer PN: ERJ-3EKF1800V; LatestRevisionDate: 25 June 2009; Supplier 1: Digi-Key; Supplier Part Number 1: P180HTR-ND; Value: 180R; Part Number: RS_180R 0603; Component Kind: Standard; Component Type: Standard; Designator: RS_180R 0603; Pin Count: 2; Signal Integrity: Res; Simulation: RESISTOR
R18 = RS_680R 0603: RES 680 OHM 1/10W 1% 0603 SMD; Manufacturer: Yageo; Manufacturer PN: RC0603FR-07680RL; LatestRevisionDate: 29 May 08; Supplier 1: Digi-Key; Value: 680R; Supplier Part Number 1: 311-680HRTR-ND; Part Number: RS_680R 0603; Component Kind: Standard; Component Type: Standard; Designator: RS_680R 0603; Pin Count: 2; Signal Integrity: Res; Simulation: RESISTOR
U2 = SN74LS47: Manufacturer: Texas Instruments; Manufacturer PN: SN74LS47NSR; Supplier 1: Digikey; Supplier Part Number 1: 296-13223-1-ND
U3 = HDSM-541C: 2 character 7 segment display; Manufacturer: AVAGO TECHNOLOGIES; Manufacturer PN: HDSM-541C; Supplier 1: Digikey; Supplier Part Number 1: 516-2248-1-ND

## Nets that join several sheets
GND: Motor_Board (9 pins), Power_Supply (20 pins), Motor_Driver (12 pins), IR (C6.2 IR_Module.1), Motor_MCU (18 pins), LED_Display (U2.8)
MOTOR_GND: Power_Supply (R4.1), Motor_Driver (8 pins)
V_3.3: Motor_Board (R41.1 R42.2 R43.2), Power_Supply (C21.2 C22.2 C23.2 L7.2), IR (R32.1), Motor_MCU (14 pins), LED_Display (U2.3 U2.5)
V_5: Motor_Board (H1.2), Power_Supply (5 pins), LED_Display (10 pins)
V_BATT: Motor_Board (H3.1 H3.2), Power_Supply (7 pins), Motor_Driver (12 pins)
V_CHARGER: Motor_Board (P1.1), Power_Supply (D10.1 D11.2 TP31.1)
Net*1_6: Motor_Board (H2.3), Motor_Driver (*1.6 D1.1 D3.2 TP3.1)
Net*2_6: Motor_Board (H2.4), Motor_Driver (*2.6 D2.1 D4.2 TP4.1)
Net*3_6: Motor_Board (H2.1), Motor_Driver (*3.6 D5.1 D7.2 TP6.1)
Net*4_6: Motor_Board (H2.2), Motor_Driver (*4.6 D6.1 D8.2 TP7.1)
PA0: Motor_MCU (*.40 P4.5), LED_Display (U2.7)
PA1: Motor_MCU (*.41 P4.4), LED_Display (U2.1)
PA2: Motor_MCU (*.42 P4.3), LED_Display (U2.2)
PA3: Motor_MCU (*.43 P4.2), LED_Display (U2.6)
PA6: Motor_MCU (*.2 P5.2), LED_Display (U2.4)
PA7: Motor_MCU (*.3 P5.3), LED_Display (R17.2 R18.2)
PB2: Motor_Board (P1.2 R41.2), Motor_MCU (*.6 P5.6)
PD0: IR (R31.1 TP1.1), Motor_MCU (*.20 P6.9)
PD2: Motor_Board (H1.3), Motor_MCU (*.22 P6.11)
PD3: Motor_Board (H1.5), Motor_MCU (*.23 P7.11)
PD4: Motor_Driver (R39.2 R40.2), Motor_MCU (*.24 P7.10)
PD5: Motor_Driver (R38.1), Motor_MCU (*.25 P7.9)
PD6: Motor_Driver (R34.1), Motor_MCU (*.26 P7.8)
PD7: Motor_Driver (R35.2 R36.2), Motor_MCU (*.27 P7.7)
PE0: Motor_Driver (Q5.1 R30.1), Motor_MCU (*.28 P7.6)
PE1: Motor_Driver (Q6.1 R29.2), Motor_MCU (*.29 P7.5)
PE2: Motor_Driver (Q4.1 R3.2), Motor_MCU (*.32 P7.2)
PE3: Motor_Driver (Q3.1 R26.1), Motor_MCU (*.33 P7.1)